# Altium schematic sheet 03_MCU.SchDoc
size A4; CheckedBy: <审核日期>; Author: llm; CompanyName: 孔乙己图书店; DocumentNumber: 3; SheetNumber: 3; SheetTotal: 6; PageSetup: Record=PageOptions|CenterHorizontal=True|CenterVertical=True|PrintScale=1.00|XCorrection=1.00|YCorrection=1.00|PrintKind=0|BorderSize=5000000|LeftOffset=0|BottomOffset=0|Orientation=2|PaperLength=1000|PaperWidth=1000|Scale=100|PaperSource=7|PrintQuality=600|MediaType=1|DitherType=10|PaperKind=A4|PrintScaleMode=1; DesignDate: <设计日期>; CheckDate: <审核人员>; SheetName: MCU系统电路; SheetVersion: Rev.E; SheetDescription: <图纸描述>; productName: Fly-Balance
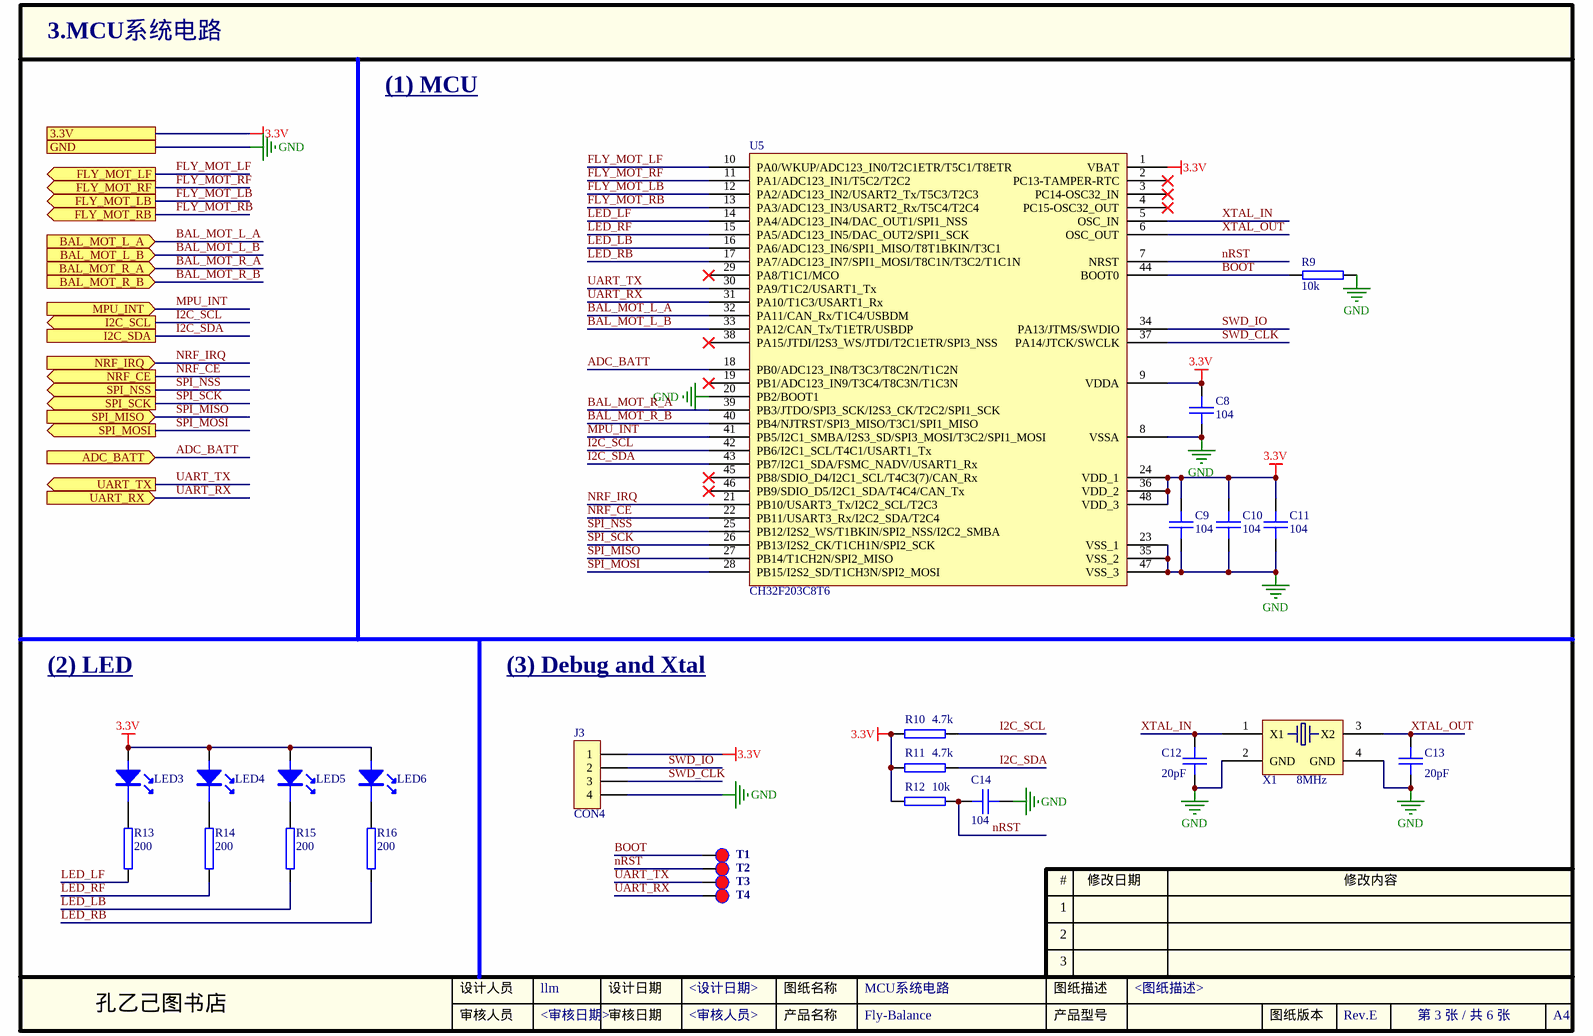
[diagram p0: 03_MCU.SchDoc]

## Parts
C8  104  [0402C]
C9  104  [0402C]
C10  104  [0402C]
C11  104  [0402C]
C12  20pF  [0402C]
C13  20pF  [0402C]
C14  104  [0402C]
J3  CON4  [SIP-4-2.54]
LED3  Blue  [LED-0603]  (value not drawn)
LED4  Blue  [LED-0603]  (value not drawn)
LED5  Blue  [LED-0603]  (value not drawn)
LED6  Blue  [LED-0603]  (value not drawn)
R9  10k  [0402R]
R10  4.7k  [0402R]
R11  4.7k  [0402R]
R12  10k  [0402R]
R13  200  [0402R]
R14  200  [0402R]
R15  200  [0402R]
R16  200  [0402R]
T1  BOOT  [PAD-40]  (value not drawn)  (no BOM)
T2  RST  [PAD-40]  (value not drawn)  (no BOM)
T3  Tx  [PAD-40]  (value not drawn)  (no BOM)
T4  Rx  [PAD-40]  (value not drawn)  (no BOM)
U5  CH32F203C8T6  [LQFP-48_7x7]
X1  8MHz  [OSCCC250X320X80-4N]

## Ports
3.3V, ADC_BATT (in), BAL_MOT_L_A (in), BAL_MOT_L_B (in), BAL_MOT_R_A (in), BAL_MOT_R_B (in), FLY_MOT_LB (out), FLY_MOT_LF (out), FLY_MOT_RB (out), FLY_MOT_RF (out), GND, I2C_SCL (out), I2C_SDA, MPU_INT (in), NRF_CE (out), NRF_IRQ (in), SPI_MISO (in), SPI_MOSI (out), SPI_NSS (out), SPI_SCK (out), UART_RX (in), UART_TX (out)

## Nets
3.3V: C8.2 C9.2 C10.2 C11.2 J3.1 LED3.1 LED4.1 LED5.1 LED6.1 R10.2 R11.2 R12.2 U5.1(VBAT) U5.9(VDDA) U5.24(VDD_1) U5.36(VDD_2) U5.48(VDD_3) ; port 3.3V
GND: C8.1 C9.1 C10.1 C11.1 C12.1 C13.1 C14.1 J3.4 R9.2 U5.8(VSSA) U5.20(PB2/BOOT1) U5.23(VSS_1) U5.35(VSS_2) U5.47(VSS_3) X1.2(GND) X1.4(GND) ; port GND
ADC_BATT: U5.18(PB0/ADC123_IN8/T3C3/T8C2N/T1C2N) ; port ADC_BATT
BAL_MOT_L_A: U5.32(PA11/CAN_Rx/T1C4/USBDM) ; port BAL_MOT_L_A
BAL_MOT_L_B: U5.33(PA12/CAN_Tx/T1ETR/USBDP) ; port BAL_MOT_L_B
BAL_MOT_R_A: U5.39(PB3/JTDO/SPI3_SCK/I2S3_CK/T2C2/SPI1_SCK) ; port BAL_MOT_R_A
BAL_MOT_R_B: U5.40(PB4/NJTRST/SPI3_MISO/T3C1/SPI1_MISO) ; port BAL_MOT_R_B
BOOT: R9.1 T1.1 U5.44(BOOT0)
FLY_MOT_LB: U5.12(PA2/ADC123_IN2/USART2_Tx/T5C3/T2C3) ; port FLY_MOT_LB
FLY_MOT_LF: U5.10(PA0/WKUP/ADC123_IN0/T2C1ETR/T5C1/T8ETR) ; port FLY_MOT_LF
FLY_MOT_RB: U5.13(PA3/ADC123_IN3/USART2_Rx/T5C4/T2C4) ; port FLY_MOT_RB
FLY_MOT_RF: U5.11(PA1/ADC123_IN1/T5C2/T2C2) ; port FLY_MOT_RF
I2C_SCL: R10.1 U5.42(PB6/I2C1_SCL/T4C1/USART1_Tx) ; port I2C_SCL
I2C_SDA: R11.1 U5.43(PB7/I2C1_SDA/FSMC_NADV/USART1_Rx) ; port I2C_SDA
LED_LB: R15.1 U5.16(PA6/ADC123_IN6/SPI1_MISO/T8T1BKIN/T3C1)
LED_LF: R13.1 U5.14(PA4/ADC123_IN4/DAC_OUT1/SPI1_NSS)
LED_RB: R16.1 U5.17(PA7/ADC123_IN7/SPI1_MOSI/T8C1N/T3C2/T1C1N)
LED_RF: R14.1 U5.15(PA5/ADC123_IN5/DAC_OUT2/SPI1_SCK)
MPU_INT: U5.41(PB5/I2C1_SMBA/I2S3_SD/SPI3_MOSI/T3C2/SPI1_MOSI) ; port MPU_INT
NRF_CE: U5.22(PB11/USART3_Rx/I2C2_SDA/T2C4) ; port NRF_CE
NRF_IRQ: U5.21(PB10/USART3_Tx/I2C2_SCL/T2C3) ; port NRF_IRQ
nRST: C14.2 R12.1 T2.1 U5.7(NRST)
SPI_MISO: U5.27(PB14/T1CH2N/SPI2_MISO) ; port SPI_MISO
SPI_MOSI: U5.28(PB15/I2S2_SD/T1CH3N/SPI2_MOSI) ; port SPI_MOSI
SPI_NSS: U5.25(PB12/I2S2_WS/T1BKIN/SPI2_NSS/I2C2_SMBA) ; port SPI_NSS
SPI_SCK: U5.26(PB13/I2S2_CK/T1CH1N/SPI2_SCK) ; port SPI_SCK
SWD_CLK: J3.3 U5.37(PA14/JTCK/SWCLK)
SWD_IO: J3.2 U5.34(PA13/JTMS/SWDIO)
UART_RX: T4.1 U5.31(PA10/T1C3/USART1_Rx) ; port UART_RX
UART_TX: T3.1 U5.30(PA9/T1C2/USART1_Tx) ; port UART_TX
XTAL_IN: C12.2 U5.5(OSC_IN) X1.1(X1)
XTAL_OUT: C13.2 U5.6(OSC_OUT) X1.3(X2)
NetLED3_2: LED3.2 R13.2
NetLED4_2: LED4.2 R14.2
NetLED5_2: LED5.2 R15.2
NetLED6_2: LED6.2 R16.2

Not connected (* = marked no-connect by the designer): U5 2(PC13-TAMPER-RTC)* 3(PC14-OSC32_IN)* 4(PC15-OSC32_OUT)* 19(PB1/ADC123_IN9/T3C4/T8C3N/T1C3N)* 29(PA8/T1C1/MCO)* 38(PA15/JTDI/I2S3_WS/JTDI/T2C1ETR/SPI3_NSS)* 45(PB8/SDIO_D4/I2C1_SCL/T4C3(7)/CAN_Rx)* 46(PB9/SDIO_D5/I2C1_SDA/T4C4/CAN_Tx)*

## Notes on the sheet
- (1) MCU
- (2) LED
- (3) Debug and Xtal
- 1
- #
- 修改日期
- 修改内容
- 2
- 3
- 设计人员
- 审核人员
- 设计日期
- 审核日期
- 产品名称
- 图纸名称
- 产品型号
- 图纸描述
- 图纸版本
- A4

## Library data of the parts
C8-C14 = CAP: 电容
J3 = CON4: Connector
LED3-LED6 = LED: 发光二极管; Value: 0603Red,SMD
R9-R16 = RES: 电阻
T1-T4 = TEST-DOT: 测试点
U5 = STM32F103C: STM32单片机48引脚
X1 = XTAL4: 4pin贴片无源晶振